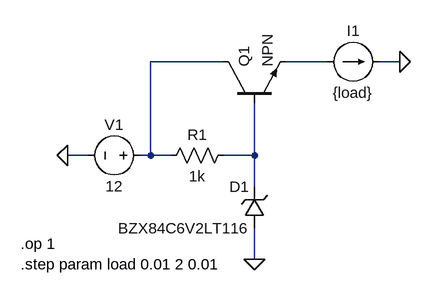
[diagram p0: schematic Tranzystor_current_sweep.asc]
Tranzystor_current_sweep.asc, the LTspice schematic file:
Version 4
SHEET 1 880 680
WIRE 240 -80 128 -80
WIRE 400 -80 336 -80
WIRE 512 -80 480 -80
WIRE 32 64 0 64
WIRE 128 64 128 -80
WIRE 128 64 112 64
WIRE 160 64 128 64
WIRE 288 64 288 -16
WIRE 288 64 240 64
WIRE 288 112 288 64
WIRE 288 224 288 176
FLAG 0 64 0
FLAG 288 224 0
FLAG 512 -80 0
SYMBOL voltage 128 64 R90
WINDOW 0 -32 56 VBottom 2
WINDOW 3 32 56 VTop 2
WINDOW 123 0 0 Left 0
WINDOW 39 0 0 Left 0
SYMATTR InstName V1
SYMATTR Value 12
SYMBOL res 256 48 R90
WINDOW 0 0 56 VBottom 2
WINDOW 3 32 56 VTop 2
SYMATTR InstName R1
SYMATTR Value 1k
SYMBOL zener 304 176 R180
WINDOW 0 24 64 Left 2
WINDOW 3 24 0 Left 2
SYMATTR InstName D1
SYMATTR Value BZX84C6V2LT116
SYMBOL npn 240 -16 R270
SYMATTR InstName Q1
SYMBOL current 400 -80 R270
WINDOW 0 32 40 VTop 2
WINDOW 3 -32 40 VBottom 2
WINDOW 123 0 0 Left 0
WINDOW 39 0 0 Left 0
SYMATTR InstName I1
SYMATTR Value {load}
TEXT -72 200 Left 2 !.op 1\n.step param load 0.01 2 0.01

The netlist it stands for:
* Tranzystor_current_sweep.asc
V1 N001 0 12
R1 N003 N001 1k
D1 0 N003 BZX84C6V2LT116
Q1 N001 N003 N002 0 NPN
I1 N002 0 {load}
.model D D
.lib standard.dio
.model NPN NPN
.model PNP PNP
.lib standard.bjt
.op 1
.step param load 0.01 2 0.01
.backanno
.end